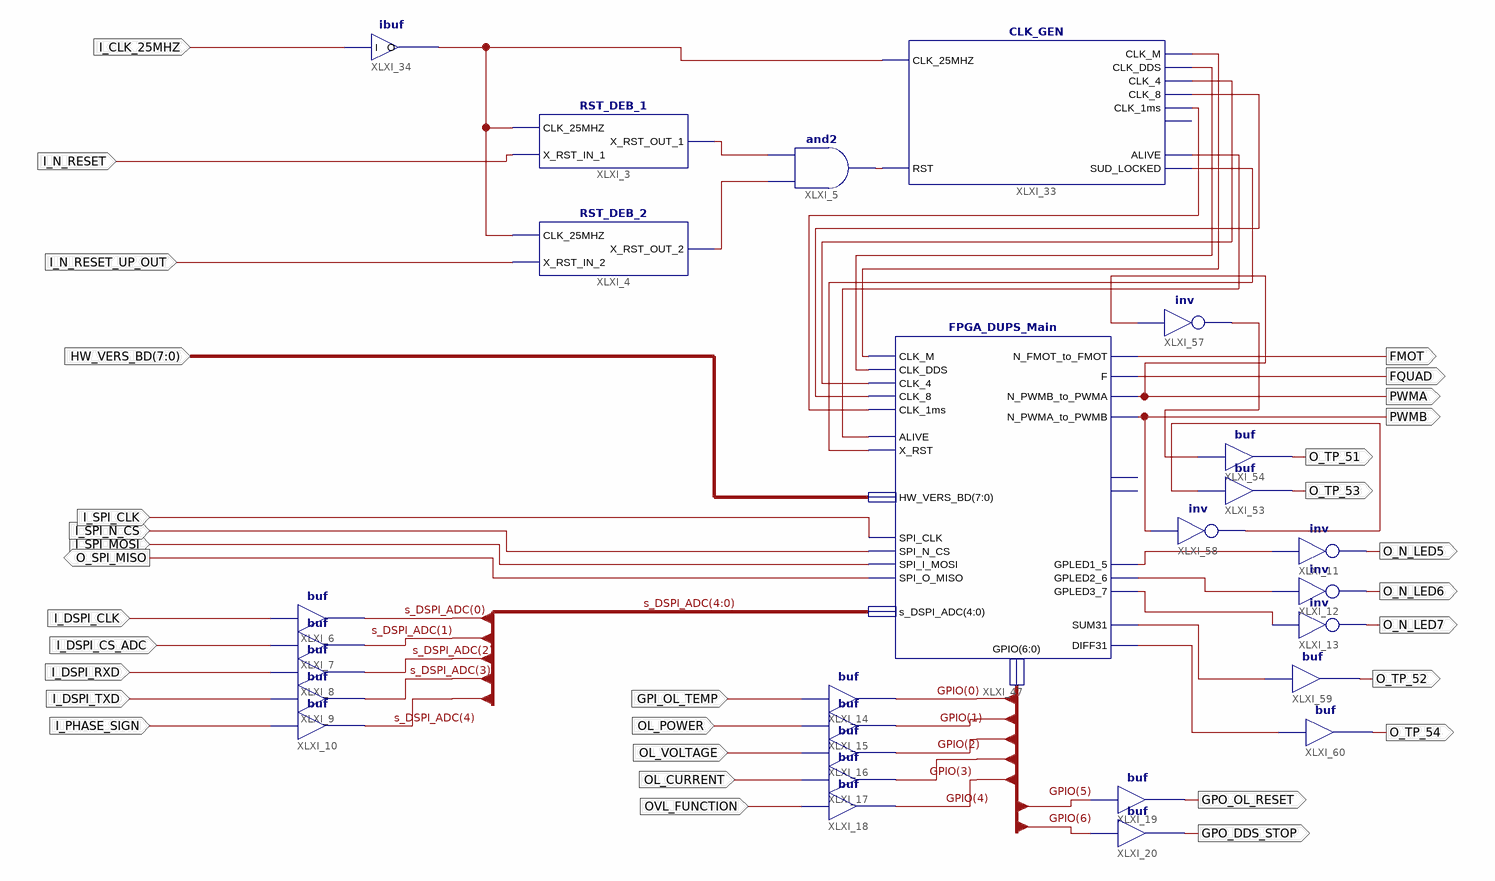
[diagram p0: schematic sheet 1]
// Xilinx ISE schematic FPGA_DUPS.sch (spartan3a) as structural Verilog: 27 symbols, 31 ports
module FPGA_DUPS (
  input  [7:0] HW_VERS_BD,
  input  I_SPI_N_CS,
  input  I_SPI_MOSI,
  input  I_DSPI_CLK,
  input  I_DSPI_CS_ADC,
  input  I_DSPI_RXD,
  input  I_DSPI_TXD,
  input  I_PHASE_SIGN,
  input  GPI_OL_TEMP,
  input  OL_POWER,
  input  OL_VOLTAGE,
  input  OL_CURRENT,
  input  OVL_FUNCTION,
  input  I_N_RESET,
  input  I_N_RESET_UP_OUT,
  input  I_CLK_25MHZ,
  input  I_SPI_CLK,
  output O_SPI_MISO,
  output O_N_LED5,
  output O_N_LED6,
  output O_N_LED7,
  output FMOT,
  output FQUAD,
  output PWMA,
  output PWMB,
  output GPO_OL_RESET,
  output GPO_DDS_STOP,
  output O_TP_53,
  output O_TP_51,
  output O_TP_52,
  output O_TP_54
);

  wire XLXN_1, XLXN_2, XLXN_56, XLXN_107, XLXN_116, XLXN_122, XLXN_139, XLXN_140, XLXN_141, XLXN_148,
       XLXN_150, XLXN_152, XLXN_176, XLXN_180, XLXN_205, XLXN_206, XLXN_209, XLXN_210;
  wire [4:0] s_DSPI_ADC;
  wire [6:0] GPIO;

  RST_DEB_1 XLXI_3 (.CLK_25MHZ(XLXN_122), .X_RST_IN_1(I_N_RESET), .X_RST_OUT_1(XLXN_1));
  RST_DEB_2 XLXI_4 (.CLK_25MHZ(XLXN_122), .X_RST_IN_2(I_N_RESET_UP_OUT), .X_RST_OUT_2(XLXN_2));
  and XLXI_5 (XLXN_56, XLXN_2, XLXN_1);
  buf XLXI_6 (s_DSPI_ADC[0], I_DSPI_CLK);
  buf XLXI_7 (s_DSPI_ADC[1], I_DSPI_CS_ADC);
  buf XLXI_8 (s_DSPI_ADC[2], I_DSPI_RXD);
  buf XLXI_9 (s_DSPI_ADC[3], I_DSPI_TXD);
  buf XLXI_10 (s_DSPI_ADC[4], I_PHASE_SIGN);
  not XLXI_11 (O_N_LED5, XLXN_139);
  not XLXI_13 (O_N_LED7, XLXN_141);
  buf XLXI_19 (GPO_OL_RESET, GPIO[5]);
  buf XLXI_20 (GPO_DDS_STOP, GPIO[6]);
  buf XLXI_14 (GPIO[0], GPI_OL_TEMP);
  buf XLXI_15 (GPIO[1], OL_POWER);
  buf XLXI_16 (GPIO[2], OL_VOLTAGE);
  buf XLXI_17 (GPIO[3], OL_CURRENT);
  buf XLXI_18 (GPIO[4], OVL_FUNCTION);
  CLK_GEN XLXI_33 (
    .CLK_M(XLXN_148), .CLK_DDS(XLXN_150), .CLK_4(XLXN_152), .CLK_8(XLXN_176), .CLK_1ms(XLXN_180),
    .ALIVE(XLXN_116), .SUD_LOCKED(XLXN_107), .RST(XLXN_56), .CLK_25MHZ(XLXN_122));  // open: CLK_FADC
  ibuf XLXI_34 (.I(I_CLK_25MHZ), .O(XLXN_122));
  not XLXI_12 (O_N_LED6, XLXN_140);
  FPGA_DUPS_Main XLXI_47 (
    .ALIVE(XLXN_116), .CLK_1ms(XLXN_180), .CLK_4(XLXN_152), .CLK_8(XLXN_176), .CLK_DDS(XLXN_150),
    .CLK_M(XLXN_148), .HW_VERS_BD(HW_VERS_BD), .SPI_CLK(I_SPI_CLK), .SPI_I_MOSI(I_SPI_MOSI),
    .SPI_N_CS(I_SPI_N_CS), .s_DSPI_ADC(s_DSPI_ADC), .X_RST(XLXN_107), .GPIO(GPIO), .F(FQUAD),
    .GPLED1_5(XLXN_139), .GPLED2_6(XLXN_140), .GPLED3_7(XLXN_141), .N_FMOT_to_FMOT(FMOT),
    .N_PWMA_to_PWMB(PWMB), .N_PWMB_to_PWMA(PWMA), .SPI_O_MISO(O_SPI_MISO), .SUM31(XLXN_209), .DIFF31(XLXN_210));  // open: FBIF_TEST_1, FBIF_TEST_2
  buf XLXI_53 (O_TP_53, XLXN_206);
  buf XLXI_54 (O_TP_51, XLXN_205);
  not XLXI_57 (XLXN_205, PWMA);
  not XLXI_58 (XLXN_206, PWMB);
  buf XLXI_59 (O_TP_52, XLXN_209);
  buf XLXI_60 (O_TP_54, XLXN_210);
endmodule
